# EAGLE design IR V 1.0_GERBER (EAGLE 7.6.0)
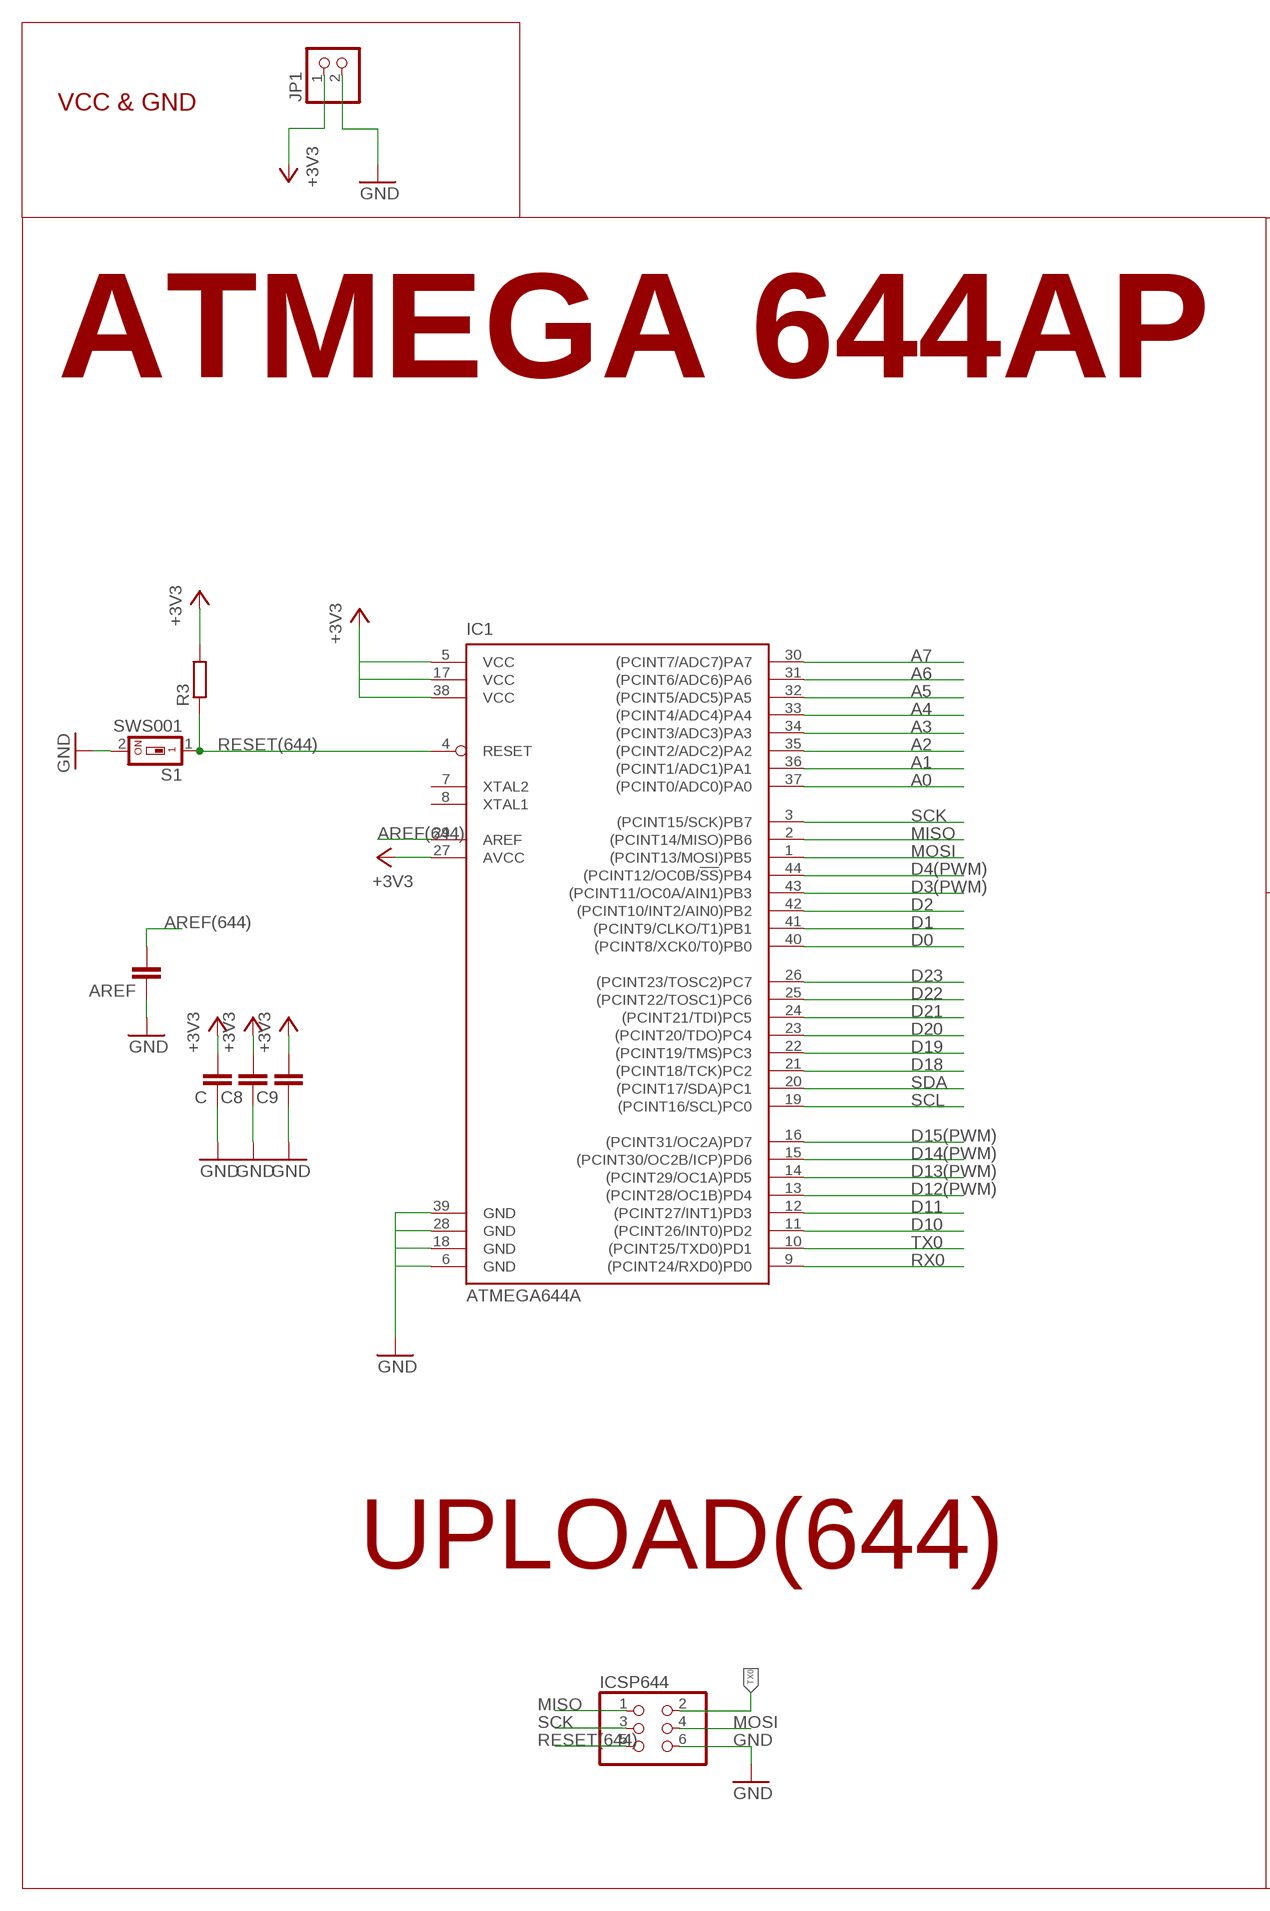
[diagram p0: schematic, sheet 1, part 1 of 2]
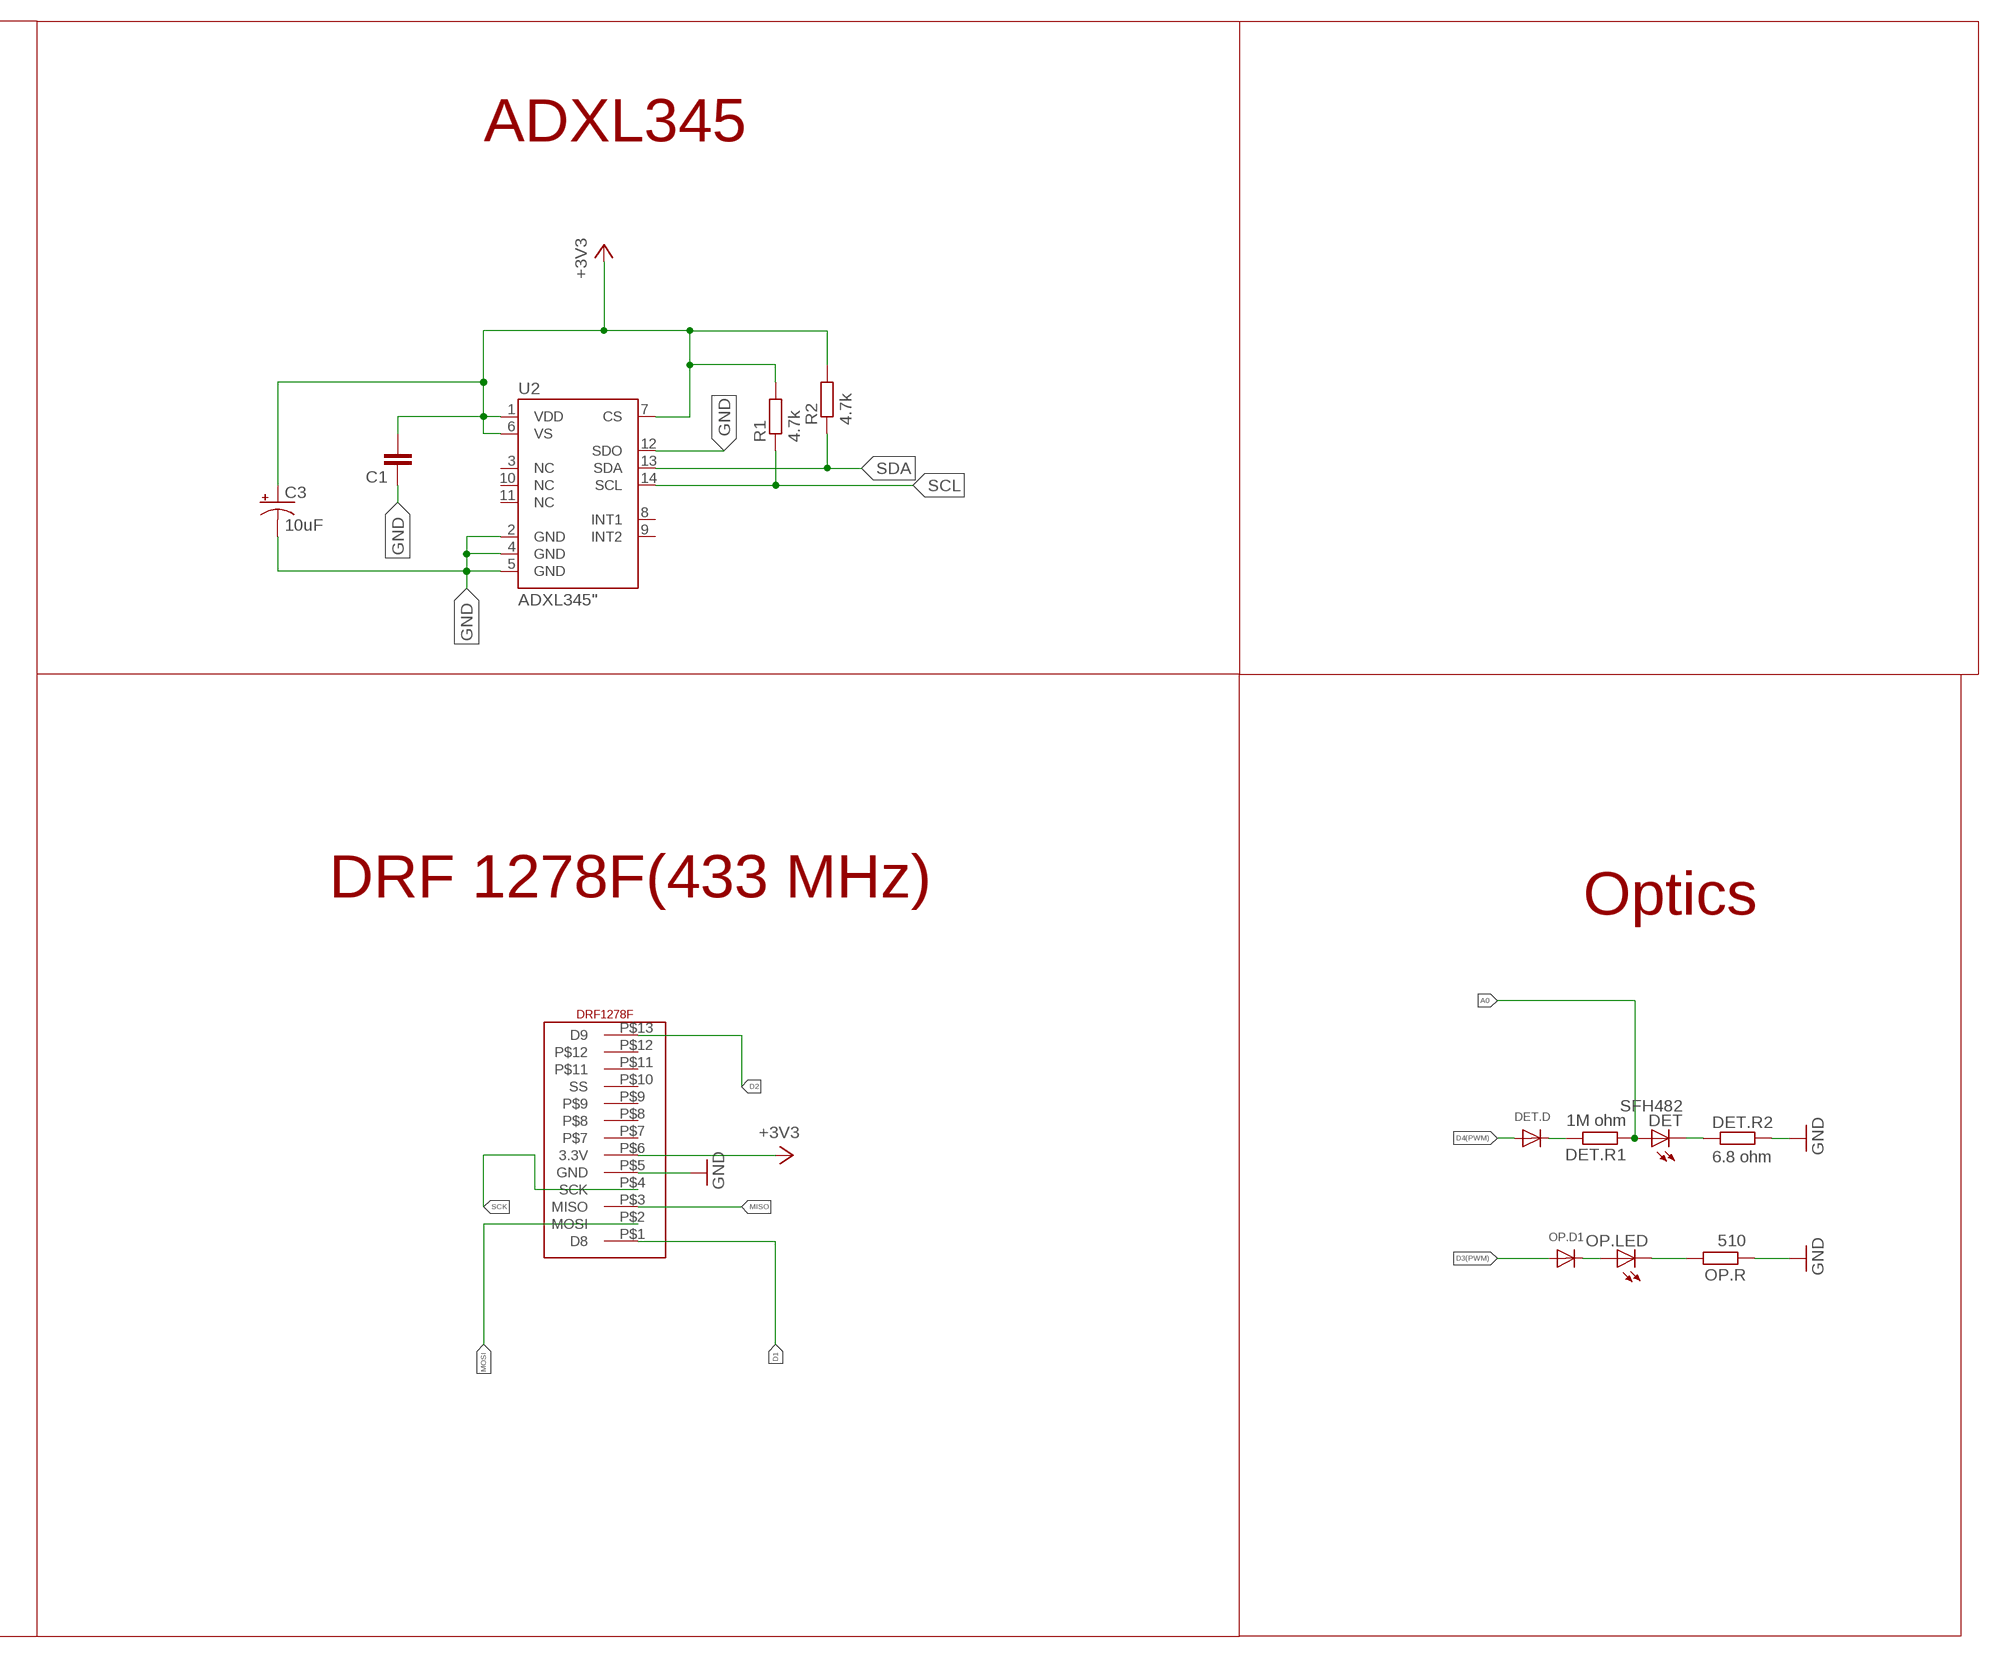
[diagram p1: schematic, sheet 1, part 2 of 2]

## Parts
AREF  100nF  C-EUC0805  [C0805]
C  22 uF  C-EUC0805  [C0805]
C1  0.1uF  C-EUC0805  [C0805]
C3  10uF  CAP_POL1206  [EIA3216]
C8  100nF  C-EUC0805  [C0805]
C9  100nF  C-EUC0805  [C0805]
DET  SFH482  [SFH482]
DET.D  DIODESOD-123  [SOD-123]
DET.R1  1M ohm  R-EU_R0805  [R0805]
DET.R2  6.8 ohm  R-EU_R0805  [R0805]
IC1  ATMEGA644A  [TQFP44]
ICSP644  PINHD-2X3  [2X03]
JP1  PINHD-1X2  [1X02]
OP.D1  DIODESOD-123  [SOD-123]
OP.LED  LED3MM  [LED3MM]
OP.R  510  R-EU_R0805  [R0805]
R1  4.7k  R-EU_R0805  [R0805]
R2  4.7k  R-EU_R0805  [R0805]
R3  R-EU_R0805  [R0805]
S1  SWS001  [SMS-001]
U2  ADXL345"  [ADXL3451:1]
U$1  DRF1278F  [DIP13]

## Nets
+3V3: C1.2 C3.A(+) C8.2 C9.2 C.2 IC1.5(VCC) IC1.17(VCC) IC1.27(AVCC) IC1.38(VCC) JP1.1 R1.2 R2.2 R3.2 U2.1(VDD) U2.6(VS) U2.7(CS) U$1.P$6(3.3V)
A0: DET.A DET.R1.1 IC1.37((PCINT0/ADC0)PA0)
A1: IC1.36((PCINT1/ADC1)PA1)
A2: IC1.35((PCINT2/ADC2)PA2)
A3: IC1.34((PCINT3/ADC3)PA3)
A4: IC1.33((PCINT4/ADC4)PA4)
A5: IC1.32((PCINT5/ADC5)PA5)
A6: IC1.31((PCINT6/ADC6)PA6)
A7: IC1.30((PCINT7/ADC7)PA7)
AREF(644): AREF.2 IC1.29(AREF)
D0: IC1.40((PCINT8/XCK0/T0)PB0)
D1: IC1.41((PCINT9/CLKO/T1)PB1) U$1.P$1(D8)
D2: IC1.42((PCINT10/INT2/AIN0)PB2) U$1.P$13(D9)
D3(PWM): IC1.43((PCINT11/OC0A/AIN1)PB3) OP.D1.A
D4(PWM): DET.D.A IC1.44((PCINT12/OC0B/!SS!)PB4)
D10: IC1.11((PCINT26/INT0)PD2)
D11: IC1.12((PCINT27/INT1)PD3)
D12(PWM): IC1.13((PCINT28/OC1B)PD4)
D13(PWM): IC1.14((PCINT29/OC1A)PD5)
D14(PWM): IC1.15((PCINT30/OC2B/ICP)PD6)
D15(PWM): IC1.16((PCINT31/OC2A)PD7)
D18: IC1.21((PCINT18/TCK)PC2)
D19: IC1.22((PCINT19/TMS)PC3)
D20: IC1.23((PCINT20/TDO)PC4)
D21: IC1.24((PCINT21/TDI)PC5)
D22: IC1.25((PCINT22/TOSC1)PC6)
D23: IC1.26((PCINT23/TOSC2)PC7)
GND: AREF.1 C1.1 C3.C(-) C8.1 C9.1 C.1 DET.R2.2 IC1.6(GND) IC1.18(GND) IC1.28(GND) IC1.39(GND) ICSP644.6 JP1.2 OP.R.1 S1.2 U2.2(GND) U2.4(GND) U2.5(GND) U2.12(SDO) U$1.P$5(GND)
MISO: IC1.2((PCINT14/MISO)PB6) ICSP644.1 U$1.P$3(MISO)
MOSI: IC1.1((PCINT13/MOSI)PB5) ICSP644.4 U$1.P$2(MOSI)
N$7: DET.D.C DET.R1.2
N$8: DET.K(C) DET.R2.1
N$11: OP.D1.C OP.LED.A
N$12: OP.LED.K(C) OP.R.2
RESET(644): IC1.4(RESET) ICSP644.5 R3.1 S1.1
RX0: IC1.9((PCINT24/RXD0)PD0)
SCK: IC1.3((PCINT15/SCK)PB7) ICSP644.3 U$1.P$4(SCK)
SCL: IC1.19((PCINT16/SCL)PC0) R1.1 U2.14(SCL)
SDA: IC1.20((PCINT17/SDA)PC1) R2.1 U2.13(SDA)
TX0: IC1.10((PCINT25/TXD0)PD1) ICSP644.2
Unconnected: IC1.7(XTAL2) IC1.8(XTAL1) U2.3(NC) U2.8(INT1) U2.9(INT2) U2.10(NC) U2.11(NC) U$1.P$7 U$1.P$8 U$1.P$9 U$1.P$10(SS) U$1.P$11 U$1.P$12

## Notes on the sheet
- VCC & GND
- ADXL345
- ATMEGA 644AP
- DRF 1278F(433 MHz) | Optics
- UPLOAD(644)

## Library data of the parts
AREF C C1 C8 C9 = rcl:C-EU: CAPACITOR, European symbol
C3 = SparkFun:CAP_POL: Capacitor Polarized These are standard SMD and PTH capacitors. Normally 10uF, 47uF, and 100uF in electrolytic and tantalum varieties. Always verify the external diameter of the through hole cap, it varies with capacity, voltage, and manufacturer. The EIA devices should be standard.
DET = led:SFH482: IR LED infrared emitting diode, Infineon
DET.D OP.D1 = adafruit:DIODE: Diode SMADIODE - SMA Surface Mount Package 20V 1A Schottky Diode Digikey: 641-1014-6-ND DO-1N4148 - Through Hole Small Current Diode SOD-123 20V 1 A (.5mV Vf) Schottky Diode - Digikey: MBRX120TPMSCT-ND SOD-323 10V 570mA (.38mV Vf, 3ns) Schottky Diode - Digikey: ZLLS410CT-ND SOD-523 30V 30mA Schottky Diode (RB751S-40TE61) - Digikey: RB751S-40TE61CT-ND SOT23-R/W - SOT23 Package (R = Solder Paste/Reflow Ovens, W = Hand-Soldering) BAT54Film 40V 300mA - Digikey: 497-7162-1-ND
DET.R1 DET.R2 OP.R R1-R3 = resistor:R-EU_: RESISTOR, European symbol
IC1 = atmel:ATMEGA644: 8-bit Microcontroller with 64K Bytes In-System Programmable Flash Source: http://www.atmel.com/dyn/resources/prod_documents/doc2593.pdf; MPN: ATMEGA644PV-10AU; OC_FARNELL: 1455123; OC_NEWARK: 58M3748
ICSP644 = pinhead:PINHD-2X3: PIN HEADER
JP1 = pinhead:PINHD-1X2: PIN HEADER
OP.LED = adafruit:LED: LED OSRAM: - CHIPLED LG R971, LG N971, LY N971, LG Q971, LY Q971, LO R971, LY R971 LH N974, LH R974 LS Q976, LO Q976, LY Q976 LO Q996 - Hyper CHIPLED LW Q18S LB Q993, LB Q99A, LB R99A - SideLED LS A670, LO A670, LY A670, LG A670, LP A670 LB A673, LV A673, LT A673, LW A673 LH A674 LY A675 LS A676, LA A676, LO A676, LY A676, LW A676 LS A679, LY A679, LG A679 - Hyper Micro SIDELED® LS Y876, LA Y876, LO Y876, LY Y876 LT Y87S - SmartLED LW L88C, LW L88S LB L89C, LB L89S, LG L890 LS L89K, LO L89K, LY L89K LS L896, LA L896, LO L896, LY L896 - TOPLED LS T670, LO T670, LY T670, LG T670, LP T670 LSG T670, LSP T670, LSY T670, LOP T670, LYG T670 LG T671, LOG T671, LSG T671 LB T673, LV T673, LT T673, LW T673 LH T674 LS T676, LA T676, LO T676, LY T676, LB T676, LH T676, LSB T676, LW T676 LB T67C, LV T67C, LT T67C, LS T67K, LO T67K, LY T67K, LW E67C LS E67B, LA E67B, LO E67B, LY E67B, LB E67C, LV E67C, LT E67C LW T67C LS T679, LY T679, LG T679 LS T770, LO T770, LY T770, LG T770, LP T770 LB T773, LV T773, LT T773, LW T773 LH T774 LS E675, LA E675, LY E675, LS T675 LS T776, LA T776, LO T776, LY T776, LB T776 LHGB T686 LT T68C, LB T68C - Hyper Mini TOPLED® LB M676 - Mini TOPLED Santana® LG M470 LS M47K, LO M47K, LY M47K Source: http://www.osram.convergy.de/
S1 = smd-special:SWS001: SMD Dip Switch 1 pol.
U2 = SparkFun-Sensors:ADXL345: 3-axis SPI/I2C 2/4/8/16g accelerometer; PROD_ID: IC-09097
U$1 = small_header:DRF1278F

## Board
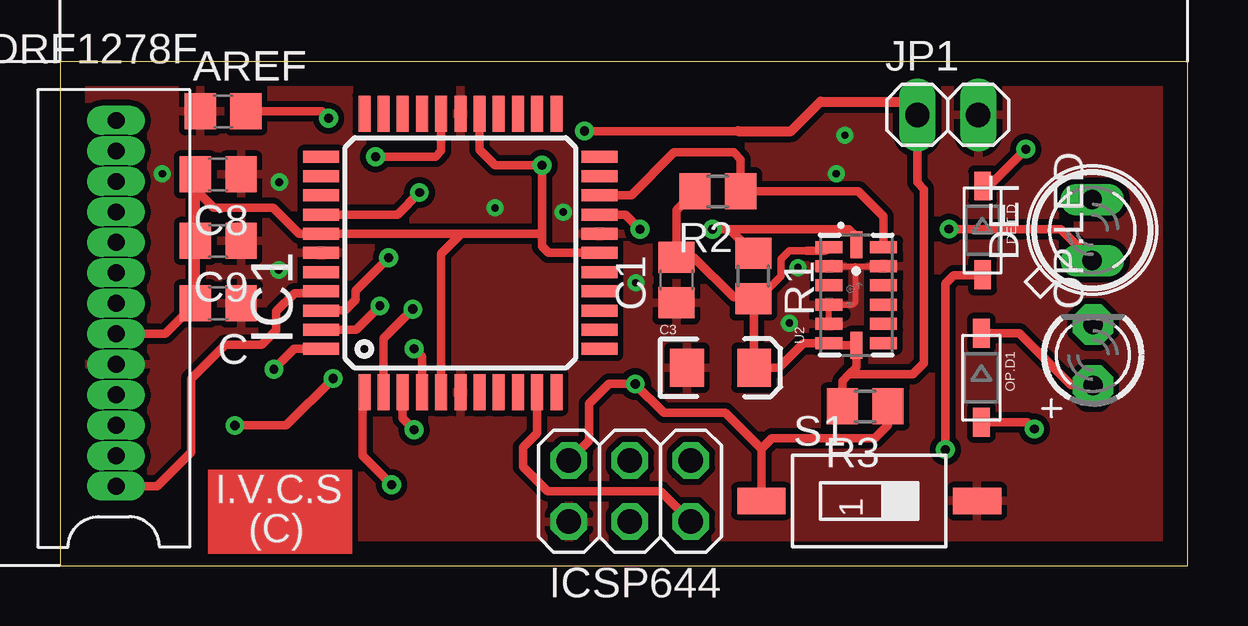
[diagram p2: board, top side]
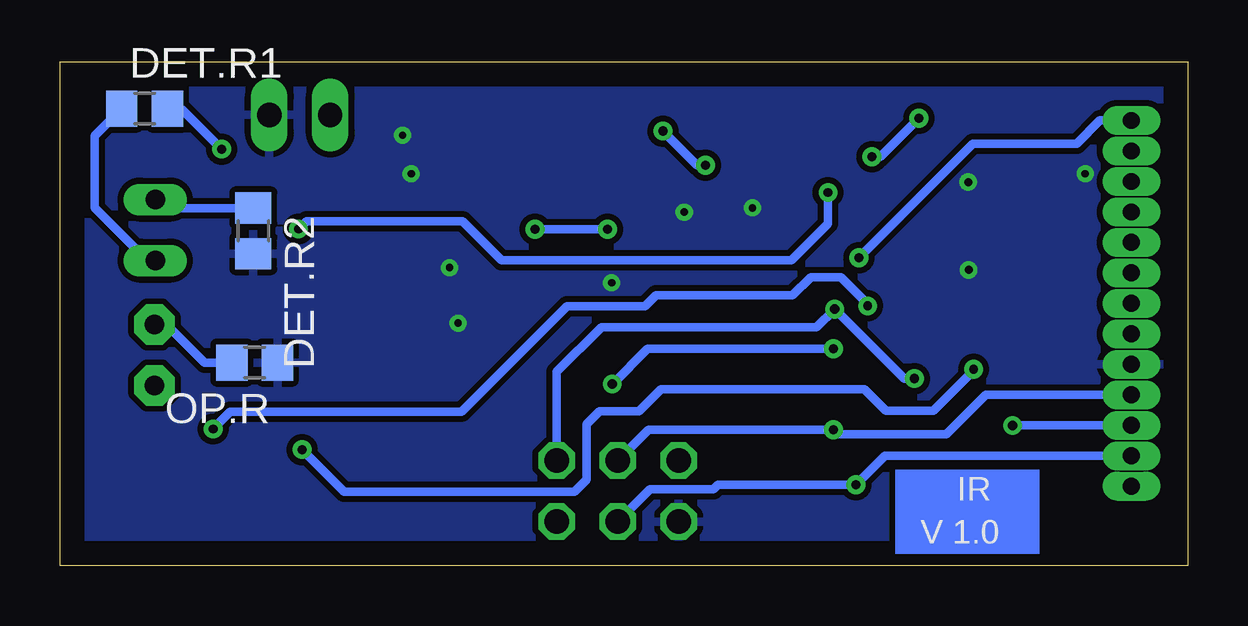
[diagram p3: board, bottom side, seen from below]

Size 47 x 21 mm. Coordinates in mm from the lower left corner, seen from the top.
Outline: 0,0 47,0 47,21 0,21 0,0
Copper layers (1*16): Top 0.035mm / dielectric 1.5mm / Bottom 0.035mm
Design rules "default *": minimum track width 9mil, minimum drill 11mil, track to track 6mil, track to pad 6mil, pad to pad 6mil, via to via 6mil, smd to smd 6mil, copper to edge 40mil, drill to drill 8mil, minimum pad ring 10mil, minimum via ring 8mil, stop-mask expansion 4mil, vias tented up to drill 0mil, thermal gap 10mil

### Footprints (pad centres in the part's own frame; a part is rotated, then mirrored left to right if it is on the bottom)
C0805 = smd 1.3 x 1.5: 1 -0.95,0; 2 0.95,0
EIA3216 = smd 1.4 x 1.6: A 1.4,0; C -1.4,0
SFH482 = drill 0.813 long: A -1.27,0; K 1.27,0
SOD-123 = smd 1.2 x 0.7: A 1.85,0; C -1.85,0
R0805 = smd 1.3 x 1.5: 1 -0.95,0; 2 0.95,0
TQFP44 = smd 1.5 x 0.5: 1 -5.8,4; 2 -5.8,3.2; 3 -5.8,2.4; 4 -5.8,1.6; 5 -5.8,0.8; 6 -5.8,0; 7 -5.8,-0.8; 8 -5.8,-1.6; 9 -5.8,-2.4; 10 -5.8,-3.2; 11 -5.8,-4; 23 5.8,-4; 24 5.8,-3.2; 25 5.8,-2.4; 26 5.8,-1.6; 27 5.8,-0.8; 28 5.8,0; 29 5.8,0.8; 30 5.8,1.6; 31 5.8,2.4; 32 5.8,3.2; 33 5.8,4 | smd 0.5 x 1.5: 12 -4,-5.8; 13 -3.2,-5.8; 14 -2.4,-5.8; 15 -1.6,-5.8; 16 -0.8,-5.8; 17 0,-5.8; 18 0.8,-5.8; 19 1.6,-5.8; 20 2.4,-5.8; 21 3.2,-5.8; 22 4,-5.8; 34 4,5.8; 35 3.2,5.8; 36 2.4,5.8; 37 1.6,5.8; 38 0.8,5.8; 39 0,5.8; 40 -0.8,5.8; 41 -1.6,5.8; 42 -2.4,5.8; 43 -3.2,5.8; 44 -4,5.8
2X03 = drill 1.016 octagon: 1 -2.54,-1.27; 2 -2.54,1.27; 3 0,-1.27; 4 0,1.27; 5 2.54,-1.27; 6 2.54,1.27
1X02 = drill 1.016 long: 1 -1.27,0; 2 1.27,0
LED3MM = drill 0.813 pad 1.676 octagon: A -1.27,0; K 1.27,0
SMS-001 = smd 1.092 x 2.007: 1 0,-4.496; 2 0,4.496
ADXL3451:1 = smd 0.5 x 1.124: 1 2,1.138; 2 1.2,1.138; 3 0.4,1.138; 4 -0.4,1.138; 5 -1.2,1.138; 6 -2,1.138; 8 -2,-1.13; 9 -1.2,-1.138; 10 -0.4,-1.138; 11 0.4,-1.138; 12 1.2,-1.138; 13 2,-1.138 | smd 1.124 x 0.5: 7 -2.1,0; 14 2.1,0
DIP13 = drill 0.7 long: P$1 -2,0; P$2 -2,-1.27; P$3 -2,-2.54; P$4 -2,-3.81; P$5 -2,-5.08; P$6 -2,-6.35; P$7 -2,-7.62; P$8 -2,-8.89; P$9 -2,-10.16; P$10 -2,-11.43; P$11 -2,-12.7; P$12 -2,-13.97; P$13 -2,-15.24

### Placement (x,y rotation side)
AREF  6.8,18.92 0 top
C  6.6,10.93 180 top
C1  25.69,11.9 90 top
C3  27.53,8.24 0 top
C8  6.6,16.3 180 top
C9  6.6,13.52 180 top
DET  43.03,13.97 90 top
DET.D  38.46,13.96 270 top
DET.R1  43.47,19.04 0 bottom
DET.R2  38.94,13.94 270 bottom
IC1  16.69,13.02 90 top
ICSP644  23.76,3.1 180 top
JP1  37.01,18.78 0 top
OP.D1  38.4,7.82 270 top
OP.LED  43.06,8.77 90 top
OP.R  38.89,8.46 180 bottom
R1  28.9,12.07 270 top
R2  27.42,15.58 180 top
R3  33.56,6.63 180 top
S1  33.73,2.69 270 top
U2  33.19,11.27 90 top
U$1  0.34,3.3 180 top

### Tracks (layer width: path | path; a pad name or v marks a point on that pad's centre or on a via)
+3V3  (via drill 0.38)
  Top 0.305: R1.2 29.11,11.12 30.05,12.06 30.05,12.77 30.4,13.12 31.11,13.12
  Top 0.356: 35.16,19.35 JP1.1 35.74,15.97 36.02,15.69 36.02,8.43 35.56,7.97 32.89,7.97 | IC1.27 17.49,17.33 18.14,16.68 v20.09,16.68 20.09,13.84 | 20.09,13.84 20.09,13.3 20.37,13.02 IC1.17 | 16.71,13.82 IC1.38 9.97,13.82 8.89,14.9 6.4,14.9 5.65,15.65 C8.2 C9.2 C.2 4.38,9.65 U$1.P$6 | 16.71,13.82 20.08,13.82 20.09,13.84 | IC1.5 15.89,13 16.71,13.82 | R3.2 32.61,7.68 32.89,7.97 | v21.87,18.1 28.27,18.1 | R2.2 25.69,14.8 C1.2 26.41,12.85 28.09,11.17 28.84,11.17 R1.2 28.93,11.08 C3.A 29.97,8.24 30.99,9.27 U2.6 32.15,9.17 U2.7 33.19,8.26 32.89,7.97 | 31.11,13.12 31.9,13.12 U2.1
  Top 0.406: 28.27,18.1 30.47,18.1 31.7,19.33 35.15,19.33 35.16,19.35
  Bottom 0.356: v20.09,16.68 20.45,16.68 v21.87,18.1
A0  (via drill 0.37)
  Top 0.356: IC1.37 14.06,14.62 v14.99,15.54 | v37.06,14.02 41.71,14.02 DET.A
  Bottom 0.356: v14.99,15.54 14.99,14.25 16.51,12.72 28.6,12.72 30.23,14.35 36.73,14.35 v37.06,14.02 | DET.R1.1 45.54,17.92 45.54,14.91 43.34,12.71 DET.A
AREF(644)  (via drill 0.38)
  Top 0.356: AREF.2 10.92,18.92 v11.2,18.64 | v13.16,17.04 15.65,17.04 15.89,17.28 IC1.29
  Bottom 0.356: v11.2,18.64 12.8,17.04 v13.16,17.04
D1
  Top 0.356: U$1.P$1 4.05,3.3 5.46,4.72 5.46,7.77 6.88,9.2 8.41,9.2 9.02,9.8 9.02,10.58 9.78,11.35 10.81,11.35 IC1.41
D2  (via drill 0.38)
  Top 0.356: IC1.42 10.9,10.63 11.88,10.63 12.32,11.07 12.32,11.45 v13.69,12.82
  Bottom 0.356: U$1.P$13 3.65,18.54 4.62,17.57 8.94,17.57 v13.69,12.82
D3(PWM)  (via drill 0.37)
  Top 0.356: IC1.43 12.34,9.82 v13.34,10.82 | v40.62,5.69 40.33,5.97 OP.D1.A
  Bottom 0.356: v13.34,10.82 13.34,10.9 14.45,12.01 15.7,12.01 16.46,11.25 22.15,11.25 22.61,10.79 25.86,10.79 30.25,6.4 39.9,6.4 v40.62,5.69
D4(PWM)  (via drill 0.37)
  Top 0.356: IC1.44 9.76,9.02 v8.91,8.18 | v36.91,4.83 36.91,11.73 37.26,12.09 38.44,12.09 DET.D.A
  Bottom 0.356: v8.91,8.18 8.91,8.13 10.59,6.45 12.57,6.45 13.46,7.34 21.95,7.34 22.86,6.43 24.51,6.43 25.04,5.89 25.04,3.58 25.55,3.07 35.15,3.07 v36.91,4.83
GND  (via drill 0.3, 0.33)
  Top 0.254: U2.2 33.15,12.47 | 33.15,12.47 U2.12 | U2.5 U2.4 33.04,10.87 33.17,11 33.17,12.44 33.15,12.47
  other vias: 32.72,17.92 18.14,14.9 32.36,16.32 30.4,10.1 24,11.78 20.98,14.72 30.76,12.41 4.27,16.32 9.14,15.98 9.12,12.32
  pour Top (isolate 0.254): 0.53,21.06 0.03,-0.14 47.15,0.36 47.15,21.06
  pour Bottom (isolate 0.254): 0.18,21.06 46.83,21.06 46.83,0.18 0.18,0.18
MISO  (via drill 0.38)
  Top 0.356: IC1.2 13.49,9.47 v14.71,10.69 | v7.29,5.83 9.42,5.83 v11.38,7.79
  Bottom 0.356: ICSP644.1 26.3,8.07 24.43,9.93 19.74,9.93 19.74,9.92 15.47,9.92 v14.71,10.69 11.81,7.79 v11.38,7.79 | U$1.P$3 7.28,5.84 v7.29,5.83
MOSI  (via drill 0.38)
  Top 0.356: IC1.1 12.62,7.16 12.62,4.57 v13.82,3.37
  Bottom 0.356: ICSP644.4 22.41,3.17 19.76,3.17 19.57,3.37 v13.82,3.37 12.62,4.57 U$1.P$2
N$7  (via drill 0.37)
  Top 0.356: v40.26,17.35 38.72,15.81 DET.D.C
  Bottom 0.356: DET.R1.2 41.95,19.04 v40.26,17.35
N$8
  Bottom 0.356: DET.K 42.68,14.89 DET.R2.1
N$11
  Top 0.356: OP.LED.A 42.16,7.5 39.98,9.68 OP.D1.C
N$12
  Bottom 0.356: OP.LED.K 42.55,10.04 40.97,8.46 OP.R.2
RESET(644)  (via drill 0.38)
  Top 0.356: S1.1 29.24,4.87 | 29.24,4.87 27.74,6.37 25.17,6.37 v23.98,7.56 v23.97,7.57 22.89,7.57 22.05,6.73 22.05,5.2 ICSP644.5 | 15.11,7.25 IC1.4 15.09,8.7 v14.76,9.03 | R3.1 34.51,5.85 33.96,5.3 29.67,5.3 29.24,4.87
  Bottom 0.356: v14.76,9.03 22.5,9.03 v23.98,7.56
SCK  (via drill 0.38)
  Top 0.356: v14.76,5.66 14.29,6.12 IC1.3
  Bottom 0.356: ICSP644.3 22.47,5.66 v14.76,5.66 14.56,5.46 10.06,5.46 8.41,7.11 U$1.P$4
SCL  (via drill 0.38)
  Top 0.356: R1.1 27.9,14.01 | 27.9,14.01 v27.2,14.01 | v24.18,14.01 23.57,14.62 IC1.19 | U2.14 33.19,13.72 32.89,14.01 27.9,14.01
  Bottom 0.356: v27.2,14.01 v24.18,14.01
SDA
  Top 0.356: U2.13 34.31,13.28 34.31,14.55 33.28,15.58 R2.1 28.37,16.93 28.09,17.21 25.6,17.21 23.81,15.42 IC1.20
TX0
  Top 0.356: ICSP644.2 25.04,3.09 20.32,3.09 19.3,4.11 19.3,4.92 19.89,5.5 IC1.10
(copper drawn outside any net)
  shapes: Bottom area x1, Top area x1

### Text on the board
tPlace: I.V.C.S | (C)
bPlace: IR | V 1.0